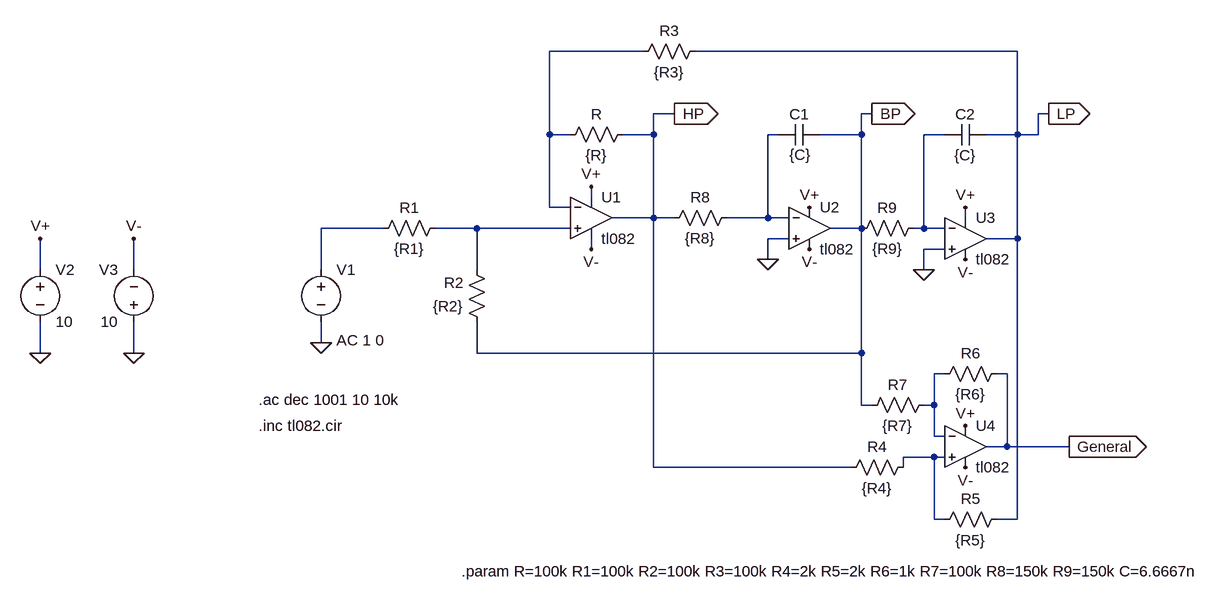
[diagram p0: schematic KHN_Universal.asc]
KHN_Universal.asc, the LTspice schematic file:
Version 4
SHEET 1 1236 680
WIRE 176 -176 32 -176
WIRE 752 -176 256 -176
WIRE 224 -80 192 -80
WIRE 528 -80 512 -80
WIRE 800 -80 784 -80
WIRE 32 -48 32 -176
WIRE 64 -48 32 -48
WIRE 192 -48 192 -80
WIRE 192 -48 144 -48
WIRE 384 -48 368 -48
WIRE 512 -48 512 -80
WIRE 512 -48 448 -48
WIRE 640 -48 608 -48
WIRE 752 -48 752 -176
WIRE 752 -48 704 -48
WIRE 784 -48 784 -80
WIRE 784 -48 752 -48
WIRE 96 48 96 32
WIRE 32 64 32 -48
WIRE 64 64 32 64
WIRE 192 80 192 -48
WIRE 192 80 128 80
WIRE 224 80 192 80
WIRE 368 80 368 -48
WIRE 368 80 304 80
WIRE 400 80 368 80
WIRE 672 80 672 64
WIRE -224 96 -320 96
WIRE -80 96 -144 96
WIRE 64 96 -80 96
WIRE 512 96 512 -48
WIRE 512 96 464 96
WIRE 608 96 608 -48
WIRE 608 96 592 96
WIRE 640 96 608 96
WIRE 400 112 368 112
WIRE 752 112 752 -48
WIRE 752 112 704 112
WIRE 96 128 96 112
WIRE 640 128 608 128
WIRE 368 144 368 112
WIRE -752 160 -752 112
WIRE -608 160 -608 112
WIRE -320 160 -320 96
WIRE -80 160 -80 96
WIRE 608 160 608 128
WIRE -320 272 -320 240
WIRE -752 288 -752 240
WIRE -608 288 -608 240
WIRE -80 288 -80 240
WIRE 512 288 512 96
WIRE 512 288 -80 288
WIRE 640 320 624 320
WIRE 736 320 720 320
WIRE 512 368 512 288
WIRE 528 368 512 368
WIRE 624 368 624 320
WIRE 624 368 608 368
WIRE 624 416 624 368
WIRE 640 416 624 416
WIRE 736 432 736 320
WIRE 736 432 704 432
WIRE 832 432 736 432
WIRE 624 448 576 448
WIRE 640 448 624 448
WIRE 192 464 192 80
WIRE 496 464 192 464
WIRE 576 464 576 448
WIRE 624 544 624 448
WIRE 640 544 624 544
WIRE 752 544 752 112
WIRE 752 544 720 544
FLAG 608 160 0
FLAG 368 144 0
FLAG -320 272 0
FLAG -608 288 0
FLAG -752 288 0
FLAG -752 112 V+
FLAG -608 112 V-
FLAG 96 128 V-
FLAG 432 128 V-
FLAG 672 144 V-
FLAG 96 32 V+
FLAG 432 64 V+
FLAG 672 64 V+
FLAG 224 -80 HP
IOPIN 224 -80 Out
FLAG 528 -80 BP
IOPIN 528 -80 Out
FLAG 800 -80 LP
IOPIN 800 -80 Out
FLAG 672 464 V-
FLAG 672 400 V+
FLAG 832 432 General
IOPIN 832 432 Out
SYMBOL res -128 80 R90
WINDOW 0 0 56 VBottom 2
WINDOW 3 32 56 VTop 2
SYMATTR InstName R1
SYMATTR Value {R1}
SYMBOL res -64 256 R180
WINDOW 0 36 76 Left 2
WINDOW 3 36 40 Left 2
SYMATTR InstName R2
SYMATTR Value {R2}
SYMBOL res 272 -192 R90
WINDOW 0 0 56 VBottom 2
WINDOW 3 32 56 VTop 2
SYMATTR InstName R3
SYMATTR Value {R3}
SYMBOL res 160 -64 R90
WINDOW 0 0 56 VBottom 2
WINDOW 3 32 56 VTop 2
SYMATTR InstName R
SYMATTR Value {R}
SYMBOL res 608 80 R90
WINDOW 0 0 56 VBottom 2
WINDOW 3 32 56 VTop 2
SYMATTR InstName R9
SYMATTR Value {R9}
SYMBOL res 320 64 R90
WINDOW 0 0 56 VBottom 2
WINDOW 3 32 56 VTop 2
SYMATTR InstName R8
SYMATTR Value {R8}
SYMBOL cap 448 -64 R90
WINDOW 0 0 32 VBottom 2
WINDOW 3 31 30 VTop 2
SYMATTR InstName C1
SYMATTR Value {C}
SYMBOL cap 704 -64 R90
WINDOW 0 0 32 VBottom 2
WINDOW 3 32 32 VTop 2
SYMATTR InstName C2
SYMATTR Value {C}
SYMBOL voltage -320 144 R0
WINDOW 3 24 96 Invisible 2
WINDOW 123 24 124 Left 2
WINDOW 39 0 0 Left 0
SYMATTR Value SINE(0 1)
SYMATTR Value2 AC 1 0
SYMATTR InstName V1
SYMBOL voltage -752 144 R0
WINDOW 123 0 0 Left 0
WINDOW 39 0 0 Left 0
SYMATTR InstName V2
SYMATTR Value 10
SYMBOL voltage -608 256 R180
WINDOW 0 24 96 Left 2
WINDOW 3 24 16 Left 2
WINDOW 123 0 0 Left 0
WINDOW 39 0 0 Left 0
SYMATTR InstName V3
SYMATTR Value 10
SYMBOL Opamps\\opamp2 96 16 R0
SYMATTR InstName U1
SYMATTR Value tl082
SYMBOL Opamps\\opamp2 432 32 R0
SYMATTR InstName U2
SYMATTR Value tl082
SYMBOL Opamps\\opamp2 672 48 R0
SYMATTR InstName U3
SYMATTR Value tl082
SYMBOL Opamps\\opamp2 672 368 R0
SYMATTR InstName U4
SYMATTR Value tl082
SYMBOL res 592 448 R90
WINDOW 0 0 56 VBottom 2
WINDOW 3 32 56 VTop 2
SYMATTR InstName R4
SYMATTR Value {R4}
SYMBOL res 736 304 R90
WINDOW 0 0 56 VBottom 2
WINDOW 3 32 56 VTop 2
SYMATTR InstName R6
SYMATTR Value {R6}
SYMBOL res 624 352 R90
WINDOW 0 0 56 VBottom 2
WINDOW 3 32 56 VTop 2
SYMATTR InstName R7
SYMATTR Value {R7}
SYMBOL res 736 528 R90
WINDOW 0 0 56 VBottom 2
WINDOW 3 32 56 VTop 2
SYMATTR InstName R5
SYMATTR Value {R5}
TEXT -416 360 Left 2 !.ac dec 1001 10 10k
TEXT -416 400 Left 2 !.inc tl082.cir
TEXT -104 624 Left 2 !.param R=100k R1=100k R2=100k R3=100k R4=2k R5=2k R6=1k R7=100k R8=150k R9=150k C=6.6667n

The netlist it stands for:
* KHN_Universal.asc
R1 N005 N004 {R1}
R2 BP N005 {R2}
R3 LP N001 {R3}
R HP N001 {R}
R9 N003 BP {R9}
R8 N002 HP {R8}
C1 BP N002 {C}
C2 LP N003 {C}
V1 N004 0 SINE(0 1) AC 1 0
V2 V+ 0 10
V3 0 V- 10
XU1 N005 N001 V+ V- HP tl082  ; pins In+ In- V+ V- OUT
XU2 0 N002 V+ V- BP tl082  ; pins In+ In- V+ V- OUT
XU3 0 N003 V+ V- LP tl082  ; pins In+ In- V+ V- OUT
XU4 N007 N006 V+ V- General tl082  ; pins In+ In- V+ V- OUT
R4 N007 HP {R4}
R6 General N006 {R6}
R7 N006 BP {R7}
R5 LP N007 {R5}
.ac dec 1001 10 10k
.inc tl082.cir
.param R=100k R1=100k R2=100k R3=100k R4=2k R5=2k R6=1k R7=100k R8=150k R9=150k C=6.6667n
.backanno
.end